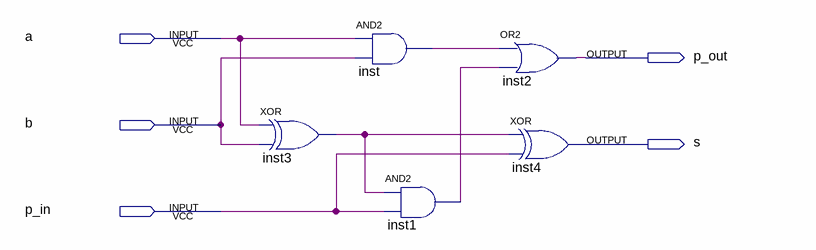
[diagram p0: schematic sheet]
// Quartus schematic Adder-1.bdf as structural Verilog: 5 symbols, 5 pins
module \Adder-1  (
  input  a,
  input  b,
  input  p_in,
  output p_out,
  output s
);

  wire inst1_out, inst3_out, inst_out;

  xor inst3 (inst3_out, a, b);
  and inst (inst_out, a, b);
  and inst1 (inst1_out, inst3_out, p_in);
  or inst2 (p_out, inst_out, inst1_out);
  xor inst4 (s, inst3_out, p_in);
endmodule
